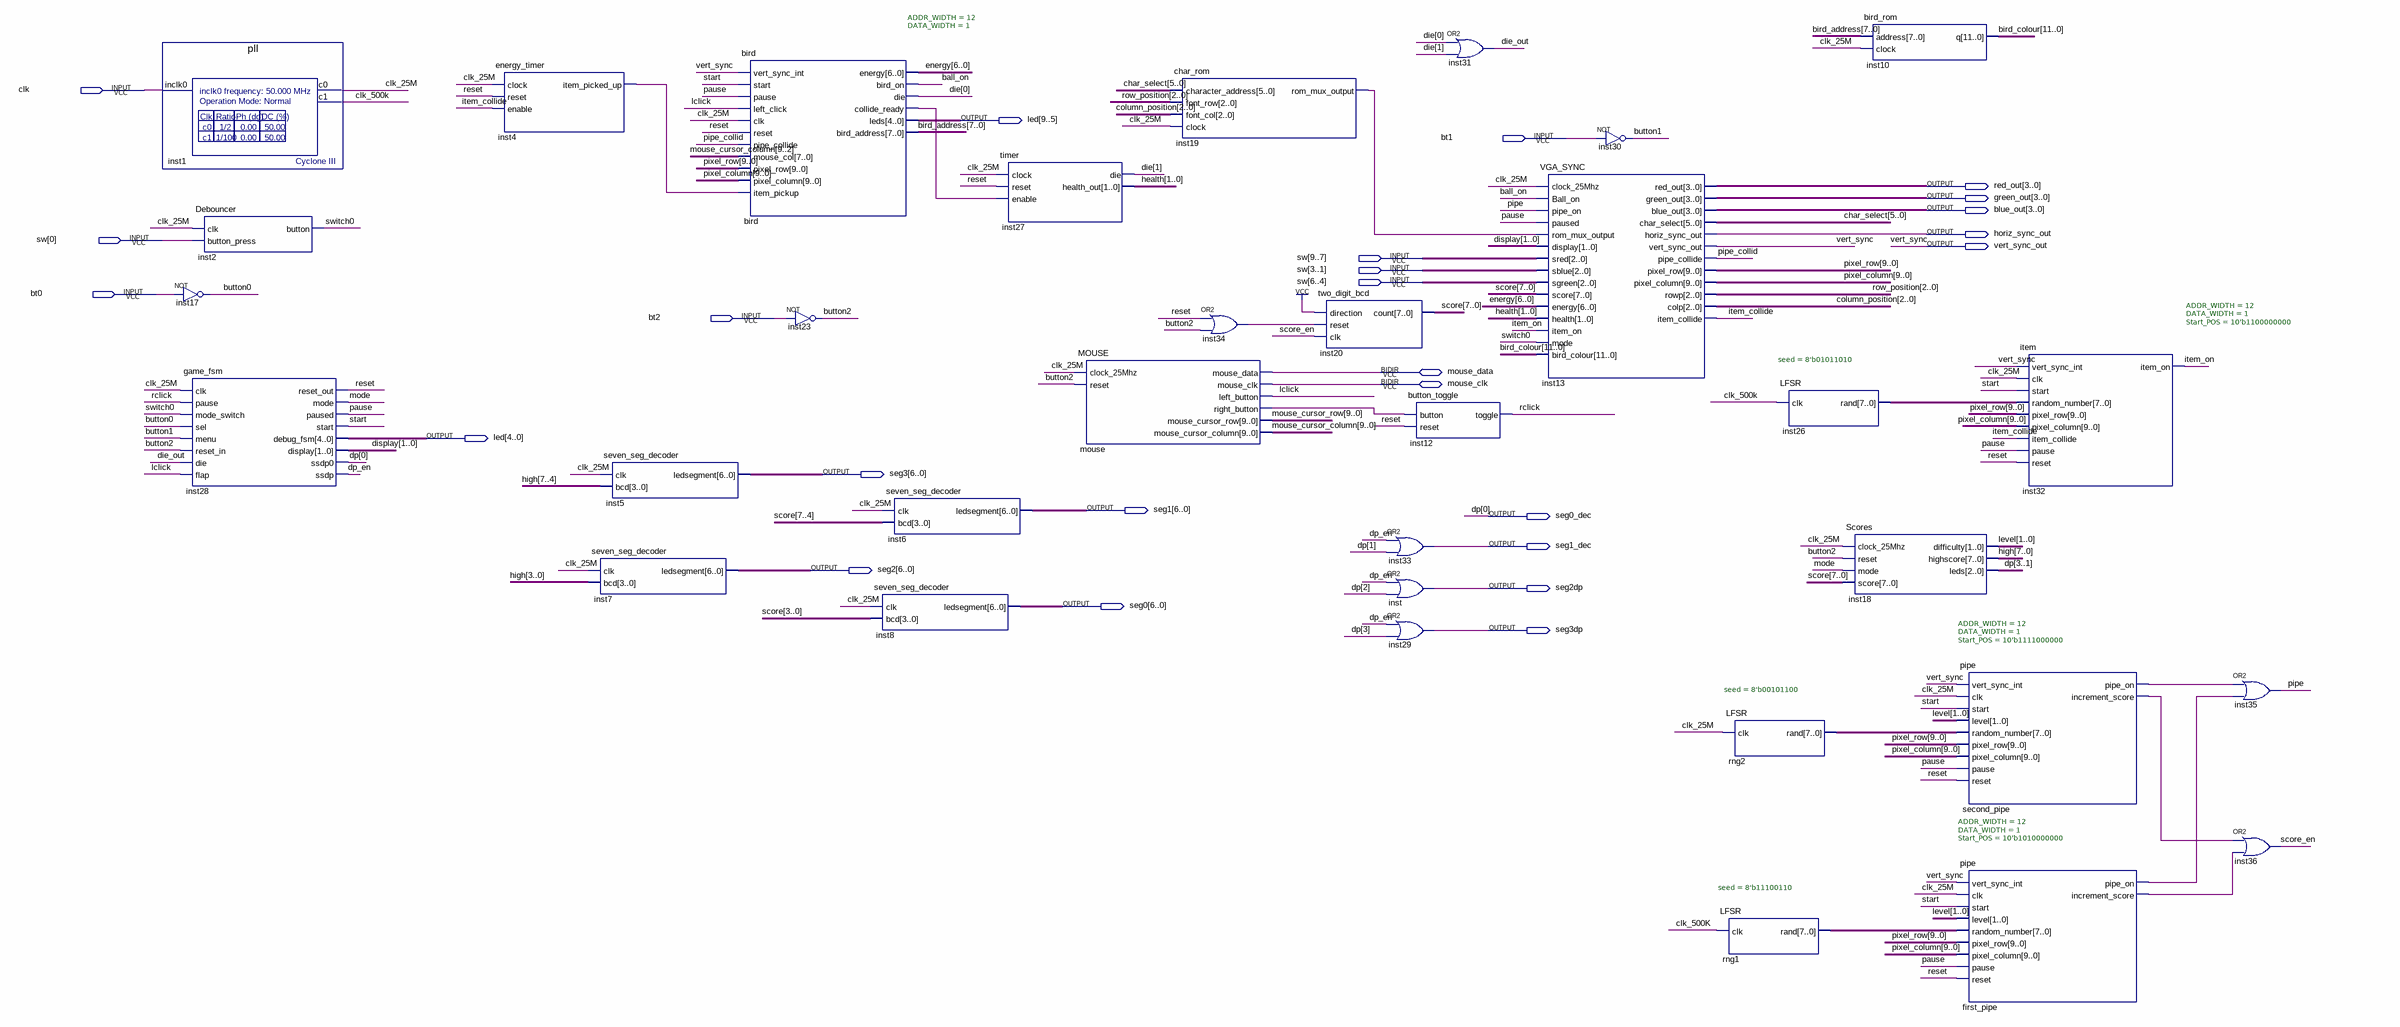
[diagram p0: schematic sheet]
// Quartus schematic MiniProject.bdf as structural Verilog: 33 symbols, 25 pins
module MiniProject (
  input  clk,
  input  bt1,
  input  [9:0] sw,
  input  bt0,
  input  bt2,
  inout  mouse_data,
  inout  mouse_clk,
  output [9:0] led,
  output [3:0] red_out,
  output [3:0] green_out,
  output [3:0] blue_out,
  output horiz_sync_out,
  output vert_sync_out,
  output [6:0] seg3,
  output [6:0] seg1,
  output seg0_dec,
  output seg1_dec,
  output [6:0] seg2,
  output seg2dp,
  output [6:0] seg0,
  output seg3dp
);

  wire ball_on, bird_collide_ready, button0, button1, button2, clk_25M, clk_500k, die_out, dp_en,
       first_pipe_increment_score, first_pipe_pipe_on, inst4_item_picked_up, inst19_rom_mux_output,
       inst34_out, item_collide, item_on, lclick, mode, mouse_right_button, pause, pipe, pipe_collid, rclick,
       reset, score_en, second_pipe_increment_score, second_pipe_pipe_on, start, switch0;
  wire [1:0] die, display, health, level;
  wire [2:0] column_position, row_position;
  wire [3:1] dp;
  wire [5:0] char_select;
  wire [6:0] energy;
  wire [7:0] bird_address, high, inst26_rand, rng1_rand, rng2_rand, score;
  wire [9:0] mouse_cursor_column, mouse_cursor_row, pixel_column, pixel_row;
  wire [11:0] bird_colour;

  pll inst1 (.inclk0(clk), .c0(clk_25M), .c1(clk_500k));
  not inst17 (button0, bt0);
  game_fsm inst28 (
    .clk(clk_25M), .pause(rclick), .mode_switch(switch0), .sel(button0), .menu(button1), .reset_in(button2),
    .die(die_out), .flap(lclick), .reset_out(reset), .mode(mode), .paused(pause), .start(start),
    .debug_fsm(led[4:0]), .display(display), .ssdp0(seg0_dec), .ssdp(dp_en));
  Debouncer inst2 (.clk(clk_25M), .button_press(sw[0]), .button(switch0));
  energy_timer inst4 (.clock(clk_25M), .reset(reset), .enable(item_collide), .item_picked_up(inst4_item_picked_up));
  seven_seg_decoder inst5 (.clk(clk_25M), .bcd(high[7:4]), .ledsegment(seg3));
  seven_seg_decoder inst7 (.clk(clk_25M), .bcd(high[3:0]), .ledsegment(seg2));
  bird #(.ADDR_WIDTH(12), .DATA_WIDTH(1)) bird (
    .vert_sync_int(vert_sync_out), .start(start), .pause(pause), .left_click(lclick), .clk(clk_25M),
    .reset(reset), .pipe_collide(pipe_collid), .mouse_col(mouse_cursor_column[9:2]), .pixel_row(pixel_row),
    .pixel_column(pixel_column), .item_pickup(inst4_item_picked_up), .energy(energy), .bird_on(ball_on),
    .die(die[0]), .collide_ready(bird_collide_ready), .leds(led[9:5]), .bird_address(bird_address));
  not inst23 (button2, bt2);
  seven_seg_decoder inst6 (.clk(clk_25M), .bcd(score[7:4]), .ledsegment(seg1));
  seven_seg_decoder inst8 (.clk(clk_25M), .bcd(score[3:0]), .ledsegment(seg0));
  timer inst27 (.clock(clk_25M), .reset(reset), .enable(bird_collide_ready), .die(die[1]), .health_out(health));
  MOUSE mouse (
    .clock_25Mhz(clk_25M), .reset(button2), .left_button(lclick), .right_button(mouse_right_button),
    .mouse_cursor_row(mouse_cursor_row), .mouse_cursor_column(mouse_cursor_column), .mouse_data(mouse_data),
    .mouse_clk(mouse_clk));
  char_rom inst19 (
    .character_address(char_select), .font_row(row_position), .font_col(column_position), .clock(clk_25M),
    .rom_mux_output(inst19_rom_mux_output));
  or inst34 (inst34_out, reset, button2);
  two_digit_bcd inst20 (.direction(1'b1), .reset(inst34_out), .clk(score_en), .count(score));
  button_toggle inst12 (.button(mouse_right_button), .reset(reset), .toggle(rclick));
  or inst33 (seg1_dec, dp_en, dp[1]);
  or inst (seg2dp, dp_en, dp[2]);
  or inst29 (seg3dp, dp_en, dp[3]);
  or inst31 (die_out, die[0], die[1]);
  VGA_SYNC inst13 (
    .clock_25Mhz(clk_25M), .Ball_on(ball_on), .pipe_on(pipe), .paused(pause),
    .rom_mux_output(inst19_rom_mux_output), .display(display), .sred(sw[9:7]), .sblue(sw[3:1]),
    .sgreen(sw[6:4]), .score(score), .energy(energy), .health(health), .item_on(item_on), .mode(switch0),
    .bird_colour(bird_colour), .red_out(red_out), .green_out(green_out), .blue_out(blue_out),
    .char_select(char_select), .horiz_sync_out(horiz_sync_out), .vert_sync_out(vert_sync_out),
    .pipe_collide(pipe_collid), .pixel_row(pixel_row), .pixel_column(pixel_column), .rowp(row_position),
    .colp(column_position), .item_collide(item_collide));
  not inst30 (button1, bt1);
  LFSR #(.seed(8'b11100110)) rng1 (.clk(clk_500k), .\rand (rng1_rand));
  LFSR #(.seed(8'b00101100)) rng2 (.clk(clk_25M), .\rand (rng2_rand));
  LFSR #(.seed(8'b01011010)) inst26 (.clk(clk_500k), .\rand (inst26_rand));
  bird_rom inst10 (.address(bird_address), .clock(clk_25M), .q(bird_colour));
  Scores inst18 (
    .clock_25Mhz(clk_25M), .reset(button2), .mode(mode), .score(score), .difficulty(level), .highscore(high),
    .leds(dp));
  pipe #(.ADDR_WIDTH(12), .DATA_WIDTH(1), .Start_POS(10'b1111000000)) second_pipe (
    .vert_sync_int(vert_sync_out), .clk(clk_25M), .start(start), .level(level), .random_number(rng2_rand),
    .pixel_row(pixel_row), .pixel_column(pixel_column), .pause(pause), .reset(reset),
    .pipe_on(second_pipe_pipe_on), .increment_score(second_pipe_increment_score));
  pipe #(.ADDR_WIDTH(12), .DATA_WIDTH(1), .Start_POS(10'b1010000000)) first_pipe (
    .vert_sync_int(vert_sync_out), .clk(clk_25M), .start(start), .level(level), .random_number(rng1_rand),
    .pixel_row(pixel_row), .pixel_column(pixel_column), .pause(pause), .reset(reset),
    .pipe_on(first_pipe_pipe_on), .increment_score(first_pipe_increment_score));
  item #(.ADDR_WIDTH(12), .DATA_WIDTH(1), .Start_POS(10'b1100000000)) inst32 (
    .vert_sync_int(vert_sync_out), .clk(clk_25M), .start(start), .random_number(inst26_rand),
    .pixel_row(pixel_row), .pixel_column(pixel_column), .item_collide(item_collide), .pause(pause),
    .reset(reset), .item_on(item_on));
  or inst35 (pipe, second_pipe_pipe_on, first_pipe_pipe_on);
  or inst36 (score_en, second_pipe_increment_score, first_pipe_increment_score);

  // Other names for the same wires on the sheet: dp[0] = seg0_dec; vert_sync = vert_sync_out
endmodule
